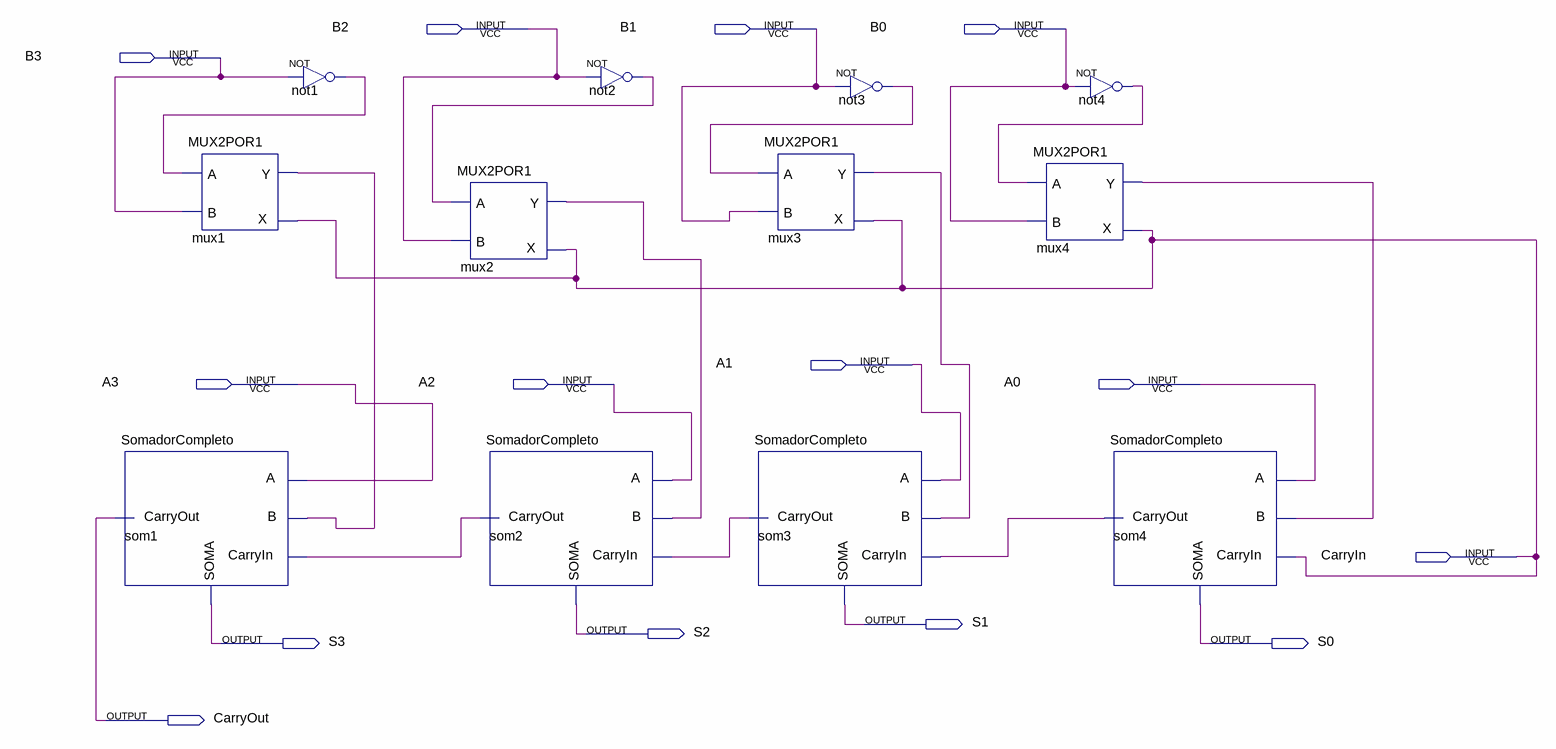
[diagram p0: schematic sheet]
// Quartus schematic SomadorSubtrator.bdf as structural Verilog: 12 symbols, 14 pins
module SomadorSubtrator (
  input  B2,
  input  B1,
  input  B0,
  input  B3,
  input  A1,
  input  A3,
  input  A2,
  input  A0,
  input  CarryIn,
  output S1,
  output S2,
  output S3,
  output S0,
  output CarryOut
);

  wire mux1_y, mux2_y, mux3_y, mux4_y, not1_out, not2_out, not3_out, not4_out, som2_carryout, som3_carryout,
       som4_carryout;

  SomadorCompleto som1 (.A(A3), .B(mux1_y), .CarryIn(som2_carryout), .CarryOut(CarryOut), .SOMA(S3));
  MUX2POR1 mux1 (.A(not1_out), .X(CarryIn), .B(B3), .Y(mux1_y));
  not not1 (not1_out, B3);
  MUX2POR1 mux2 (.A(not2_out), .X(CarryIn), .B(B2), .Y(mux2_y));
  SomadorCompleto som2 (.A(A2), .B(mux2_y), .CarryIn(som3_carryout), .CarryOut(som2_carryout), .SOMA(S2));
  not not2 (not2_out, B2);
  MUX2POR1 mux3 (.A(not3_out), .X(CarryIn), .B(B1), .Y(mux3_y));
  SomadorCompleto som3 (.A(A1), .B(mux3_y), .CarryIn(som4_carryout), .CarryOut(som3_carryout), .SOMA(S1));
  not not3 (not3_out, B1);
  not not4 (not4_out, B0);
  MUX2POR1 mux4 (.A(not4_out), .X(CarryIn), .B(B0), .Y(mux4_y));
  SomadorCompleto som4 (.A(A0), .B(mux4_y), .CarryIn(CarryIn), .CarryOut(som4_carryout), .SOMA(S0));
endmodule
